# EAGLE design A4a STM32 Adaptor (EAGLE 9.6.1)
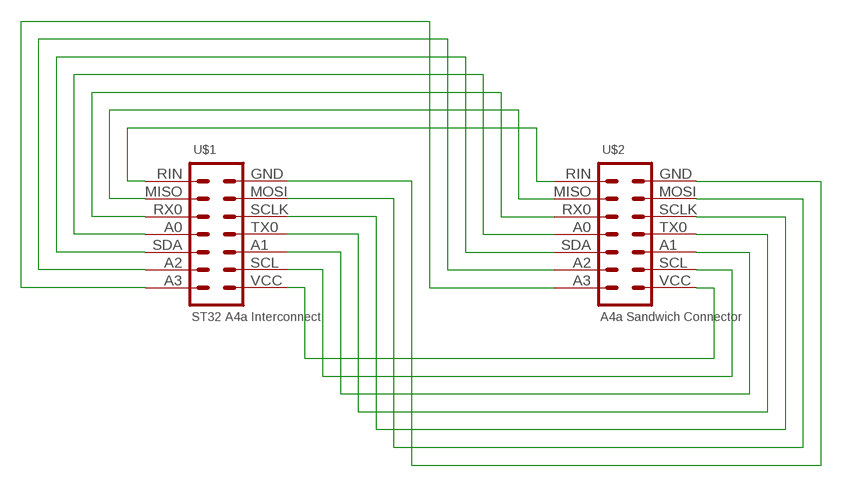
[diagram p0: schematic, sheet 1]

## Parts
U$1  ST32 A4a Interconnect  HEADER-3X5-ALF4ALL-STM32-INTERCONNECT-B  [CONN_3X5-ALF4ALL-STM32-INTERCONNECT-B]
U$2  A4a Sandwich Connector  HEADER-2X7-ALF4ALL-PROCESSOR-B  [CONN_2X7-ALF4ALL-PROCESSOR-B]

## Nets
GND: U$1.GND U$2.GND
N$1: U$1.RIN U$2.RIN
N$2: U$1.MISO U$2.MISO
N$3: U$1.RX0 U$2.RX0
N$4: U$1.A3 U$2.A3
N$5: U$1.A2 U$2.A2
N$6: U$1.SDA U$2.SDA
N$7: U$1.A0 U$2.A0
N$9: U$1.SCL U$2.SCL
N$10: U$1.A1 U$2.A1
N$11: U$1.TX0 U$2.TX0
N$12: U$1.SCLK U$2.SCLK
N$13: U$1.MOSI U$2.MOSI
VCC: U$1.VCC U$2.VCC

## Library data of the parts
U$1 = digitalconcepts:HEADER-3X5-ALF4ALL-STM32-INTERCONNECT-B: ALF4all 'Sandwich' STM32 Interconnect 3x5 Pin Header Header soldered to bottom side of PCB
U$2 = digitalconcepts:HEADER-2X7-ALF4ALL-PROCESSOR-B: ALF4all 'Sandwich' Processor (Bottom) 2x7 Pin Header Header soldered to underside of PCB

## Board
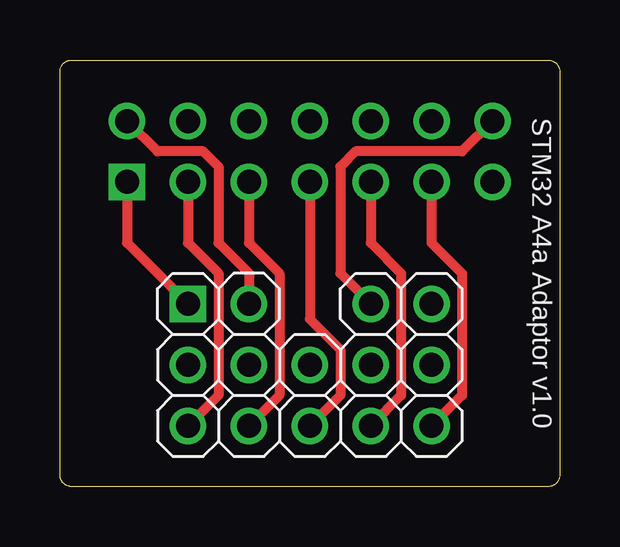
[diagram p1: board, top side]
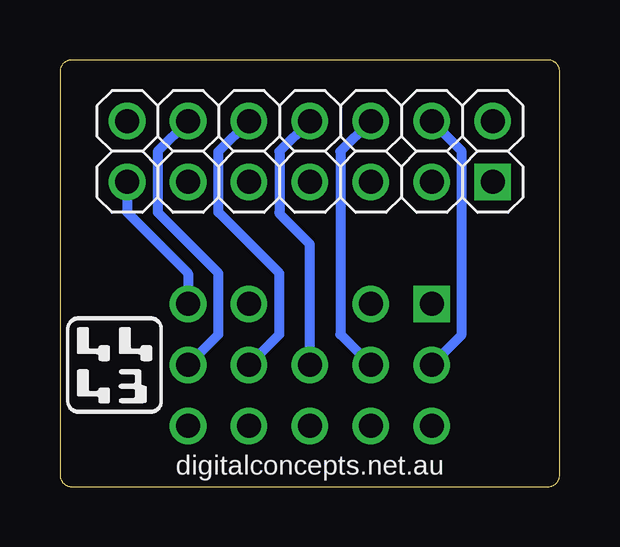
[diagram p2: board, bottom side, seen from below]

Size 20.84 x 17.78 mm. Coordinates in mm from the lower left corner, seen from the top.
Outline: 20.84,0.46 20.84,0.42 20.83,0.39 20.83,0.36 20.82,0.33 20.8,0.3 20.79,0.27 20.77,0.24 20.76,0.22 20.74,0.19 20.72,0.17 20.7,0.14 20.67,0.12 20.65,0.1 20.62,0.08 20.6,0.07 20.57,0.05 20.54,0.04 20.51,0.03 20.48,0.02 20.44,0.01 20.41,0 20.38,0 0.47,0 0.43,0 0.4,0.01 0.37,0.02 0.33,0.03 0.31,0.04 0.28,0.05 0.25,0.07 0.22,0.08 0.19,0.1 0.17,0.12 0.15,0.14 0.12,0.17 0.1,0.19 0.09,0.22 0.07,0.24 0.05,0.27 0.04,0.3 0.03,0.33 0.02,0.36 0.01,0.39 0,0.42 0,0.46 0,17.32 0,17.35 0.01,17.38 0.02,17.42 0.03,17.45 0.05,17.51 0.07,17.53 0.09,17.56 0.1,17.59 0.12,17.61 0.15,17.63 0.17,17.66 0.19,17.68 0.22,17.69 0.25,17.71 0.28,17.73 0.31,17.74 0.33,17.75 0.37,17.76 0.4,17.77 0.43,17.77 0.47,17.78 20.38,17.78 20.41,17.77 20.44,17.77 20.48,17.76 20.51,17.75 20.54,17.74 20.57,17.73 20.6,17.71 20.62,17.69 20.65,17.68 20.67,17.66 20.72,17.61 20.74,17.59 20.76,17.56 20.77,17.53 20.79,17.51 20.8,17.48 20.82,17.45 20.83,17.42 20.83,17.38 20.84,17.35 20.84,17.32 20.84,0.46
Copper layers (1*16): Top 0.035mm / dielectric 1.5mm / Bottom 0.035mm
Design rules "default *": minimum track width 6mil, minimum drill 0.35mm, track to track 6mil, track to pad 6mil, pad to pad 6mil, via to via 6mil, smd to smd 6mil, copper to edge 6mil, drill to drill 6mil, minimum pad ring 10mil, minimum via ring 8mil, stop-mask expansion 4mil, vias tented up to drill 0mil, thermal gap 10mil

### Footprints (pad centres in the part's own frame; a part is rotated, then mirrored left to right if it is on the bottom)
CONN_3X5-ALF4ALL-STM32-INTERCONNECT-B = drill 1 pad 1.524: A0 5.08,-2.54; A1 2.54,-5.08; A2 0,-2.54; A3 2.54,0; GND 10.16,0; MISO 10.16,-2.54; MOSI 10.16,-5.08; RIN 7.62,0; RX0 7.62,-2.54; SCL 0,-5.08; SCLK 7.62,-5.08; SDA 2.54,-2.54; TX0 5.08,-5.08 | drill 1 pad 1.524 square: VCC 0,0
CONN_2X7-ALF4ALL-PROCESSOR-B = drill 1 pad 1.524: A0 7.62,2.54; A1 5.08,0; A2 2.54,2.54; A3 0,2.54; GND 15.24,0; MISO 12.7,2.54; MOSI 12.7,0; RIN 15.24,2.54; RX0 10.16,2.54; SCL 2.54,0; SCLK 10.16,0; SDA 5.08,2.54; TX0 7.62,0 | drill 1 pad 1.524 square: VCC 0,0

### Placement (x,y rotation side)
U$1  5.34,7.62 0 top
U$2  2.8,12.7 0 top

### Tracks (layer width: path | path; a pad name or v marks a point on that pad's centre or on a via)
GND
  Bottom 0.406: U$2.GND 18.04,11.43 15.5,8.89 U$1.GND
N$1
  Top 0.406: U$2.RIN 16.77,13.97 12.32,13.97 11.69,13.33 11.69,8.89 U$1.RIN
N$2
  Bottom 0.406: U$2.MISO 16.77,13.97 16.77,11.43 14.23,8.89 14.23,6.35 U$1.MISO
N$3
  Bottom 0.406: U$2.RX0 14.23,13.97 14.23,11.43 11.69,8.89 11.69,6.35 U$1.RX0
N$4
  Top 0.406: U$2.A3 4.07,13.97 5.97,13.97 6.61,13.33 6.61,10.16 7.88,8.89 U$1.A3
N$5
  Bottom 0.406: U$2.A2 4.11,14 4.11,6.31 U$1.A2
N$6
  Bottom 0.406: U$2.SDA 9.15,13.97 9.15,6.35 U$1.SDA
N$7
  Bottom 0.406: U$1.A0 10.42,10.1 11.67,11.35 11.69,11.43 11.69,13.97 U$2.A0
N$9
  Top 0.406: U$2.SCL 5.34,10.16 6.61,8.89 6.61,3.81 U$1.SCL
N$10
  Top 0.406: U$2.A1 7.88,10.16 9.15,8.89 9.15,3.81 U$1.A1
N$11
  Top 0.406: U$2.TX0 10.42,6.98 11.69,5.71 11.69,3.81 U$1.TX0
N$12
  Top 0.406: U$2.SCLK 12.96,10.16 14.23,8.89 14.23,3.81 U$1.SCLK
N$13
  Top 0.406: U$2.MOSI 15.5,10.16 16.77,8.89 16.77,3.81 U$1.MOSI
VCC
  Top 0.406: U$2.VCC 2.8,10.16 U$1.VCC

### Text on the board
tPlace: STM32 A4a Adaptor v1.0
bPlace: digitalconcepts.net.au